# EAGLE design Christmas_Lights (EAGLE 7.5.0)
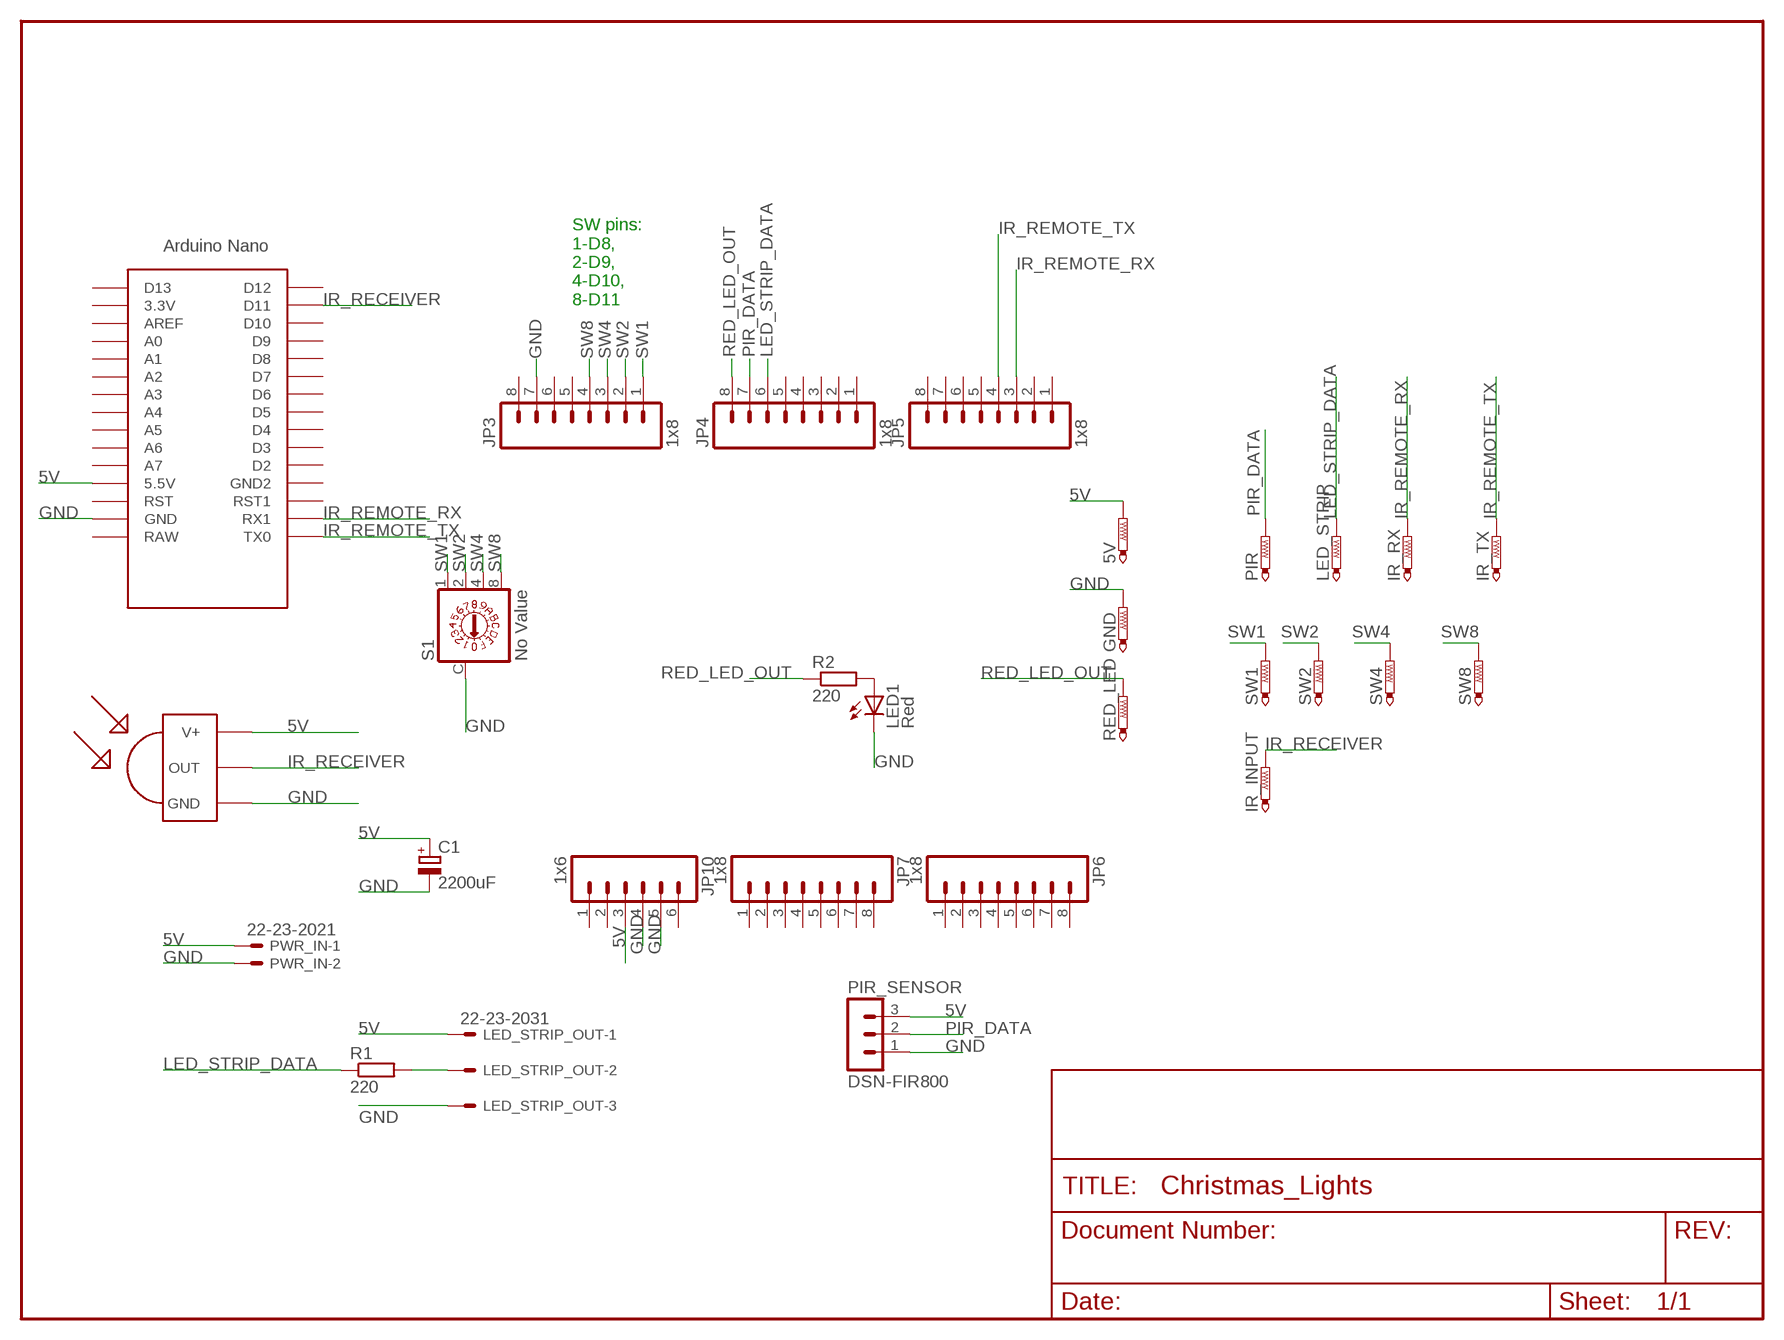
[diagram p0: schematic, sheet 1]

## Parts
5V  PTR1PAD1-13  [P1-13]
C1  2200uF  CPOL-EUE5-13  [E5-13]
GND  PTR1PAD1-13  [P1-13]
IR_INPUT  PTR1PAD1-13  [P1-13]
IR_RX  PTR1PAD1-13  [P1-13]
IR_TX  PTR1PAD1-13  [P1-13]
JP3  1x8  M08LOCK  [1X08_LOCK]
JP4  1x8  M08LOCK  [1X08_LOCK]
JP5  1x8  M08LOCK  [1X08_LOCK]
JP6  1x8  M08LOCK  [1X08_LOCK]
JP7  1x8  M08LOCK  [1X08_LOCK]
JP10  1x6  M06LOCK  [1X06_LOCK]
LED1  Red  LED5MM  [LED5MM]
LED_STRIP  PTR1PAD1-13  [P1-13]
LED_STRIP_OUT  22-23-2031  [22-23-2031]
PIR  PTR1PAD1-13  [P1-13]
PIR_SENSOR  DSN-FIR800  MA03-1  [MA03-1]
PWR_IN  22-23-2021  [22-23-2021]
R1  220  R-EU_0204/7  [0204/7]
R2  220  R-EU_0204/7  [0204/7]
RED_LED  PTR1PAD1-13  [P1-13]
S1  No Value  P103  [P103]
SW1  PTR1PAD1-13  [P1-13]
SW2  PTR1PAD1-13  [P1-13]
SW4  PTR1PAD1-13  [P1-13]
SW8  PTR1PAD1-13  [P1-13]
TSOP31328  TSOP 31238  TSOP1730  [TSOP17XX]
U$1  NANO  [NANO]

## Nets
5V [POWER]: 5V.TP C1.+ JP10.3 LED_STRIP_OUT.1 PIR_SENSOR.3 PWR_IN.1 TSOP31328.V+ U$1.5V(5.5V)
GND [POWER]: C1.- GND.TP JP3.7 JP10.4 JP10.5 LED1.K(C) LED_STRIP_OUT.3 PIR_SENSOR.1 PWR_IN.2 S1.C TSOP31328.GND U$1.GND
IR_RECEIVER: IR_INPUT.TP TSOP31328.OUT U$1.D11
IR_REMOTE_RX: IR_RX.TP JP5.3 U$1.RX1
IR_REMOTE_TX: IR_TX.TP JP5.4 U$1.TX0
LED_STRIP_DATA: JP4.6 LED_STRIP.TP R1.1
N$1: LED_STRIP_OUT.2 R1.2
N$3: LED1.A R2.2
PIR_DATA: JP4.7 PIR.TP PIR_SENSOR.2
RED_LED_OUT: JP4.8 R2.1 RED_LED.TP
SW1: JP3.1 S1.1 SW1.TP
SW2: JP3.2 S1.2 SW2.TP
SW4: JP3.3 S1.4 SW4.TP
SW8: JP3.4 S1.8 SW8.TP
Unconnected: JP3.5 JP3.6 JP3.8 JP4.1 JP4.2 JP4.3 JP4.4 JP4.5 JP5.1 JP5.2 JP5.5 JP5.6 JP5.7 JP5.8 JP6.1 JP6.2 JP6.3 JP6.4 JP6.5 JP6.6 JP6.7 JP6.8 JP7.1 JP7.2 JP7.3 JP7.4 JP7.5 JP7.6 JP7.7 JP7.8 JP10.1 JP10.2 JP10.6 U$1.3.3V U$1.A0 U$1.A1 U$1.A2 U$1.A3 U$1.A4 U$1.A5 U$1.A6 U$1.A7 U$1.AREF U$1.D2 U$1.D3 U$1.D4 U$1.D5 U$1.D6 U$1.D7 U$1.D8 U$1.D9 U$1.D10 U$1.D12 U$1.D13 U$1.GND1(GND2) U$1.ICSP1 U$1.ICSP2 U$1.ICSP3 U$1.ICSP4 U$1.ICSP5 U$1.ICSP6 U$1.RAW U$1.RST U$1.RST1

## Notes on the sheet
- SW pins: 
  1-D8,
  2-D9,
  4-D10,
  8-D11

## Library data of the parts
5V GND IR_INPUT IR_RX IR_TX LED_STRIP PIR RED_LED SW1 SW2 SW4 SW8 = testpad:PTR1: TEST PIN
C1 = rcl:CPOL-EU: POLARIZED CAPACITOR, European symbol
JP3-JP7 = SparkFun:M08: Header 8 Standard 8-pin 0.1" header. Use with straight break away headers (SKU : PRT-00116), right angle break away headers (PRT-00553), swiss pins (PRT-00743), machine pins (PRT-00117), and female headers (PRT-00115).
JP10 = SparkFun:M06: Header 6 Standard 6-pin 0.1" header. Use with straight break away headers (SKU : PRT-00116), right angle break away headers (PRT-00553), swiss pins (PRT-00743), machine pins (PRT-00117), and female headers (PRT-00115). Molex polarized connector foot print use with SKU : PRT-08094 with associated crimp pins and housings. NOTES ON THE VARIANTS LOCK and LOCK_LONGPADS... This footprint was designed to help hold the alignment of a through-hole component (i.e. 6-pin header) while soldering it into place. You may notice that each hole has been shifted either up or down by 0.005 of an inch from it's more standard position (which is a perfectly straight line). This slight alteration caused the pins (the squares in the middle) to touch the edges of the holes. Because they are alternating, it causes a "brace" to hold the component in place. 0.005 has proven to be the perfect amount of "off-center" position when using our standard breakaway headers. Although looks a little odd when you look at the bare footprint, once you have a header in there, the alteration is very hard to notice. Also, if you push a header all the way into place, it is covered up entirely on the bottom side. This idea of altering the position of holes to aid alignment will be further integrated into the Sparkfun Library for other footprints. It can help hold any component with 3 or more connection pins.
LED1 = led:LED: LED OSRAM: - CHIPLED LG R971, LG N971, LY N971, LG Q971, LY Q971, LO R971, LY R971 LH N974, LH R974 LS Q976, LO Q976, LY Q976 LO Q996 - Hyper CHIPLED LW Q18S LB Q993, LB Q99A, LB R99A - SideLED LS A670, LO A670, LY A670, LG A670, LP A670 LB A673, LV A673, LT A673, LW A673 LH A674 LY A675 LS A676, LA A676, LO A676, LY A676, LW A676 LS A679, LY A679, LG A679 - Hyper Micro SIDELED® LS Y876, LA Y876, LO Y876, LY Y876 LT Y87S - SmartLED LW L88C, LW L88S LB L89C, LB L89S, LG L890 LS L89K, LO L89K, LY L89K LS L896, LA L896, LO L896, LY L896 - TOPLED LS T670, LO T670, LY T670, LG T670, LP T670 LSG T670, LSP T670, LSY T670, LOP T670, LYG T670 LG T671, LOG T671, LSG T671 LB T673, LV T673, LT T673, LW T673 LH T674 LS T676, LA T676, LO T676, LY T676, LB T676, LH T676, LSB T676, LW T676 LB T67C, LV T67C, LT T67C, LS T67K, LO T67K, LY T67K, LW E67C LS E67B, LA E67B, LO E67B, LY E67B, LB E67C, LV E67C, LT E67C LW T67C LS T679, LY T679, LG T679 LS T770, LO T770, LY T770, LG T770, LP T770 LB T773, LV T773, LT T773, LW T773 LH T774 LS E675, LA E675, LY E675, LS T675 LS T776, LA T776, LO T776, LY T776, LB T776 LHGB T686 LT T68C, LB T68C - Hyper Mini TOPLED® LB M676 - Mini TOPLED Santana® LG M470 LS M47K, LO M47K, LY M47K Source: http://www.osram.convergy.de LUXEON: - LUMILED® LXK2-PW12-R00, LXK2-PW12-S00, LXK2-PW14-U00, LXK2-PW14-V00 LXK2-PM12-R00, LXK2-PM12-S00, LXK2-PM14-U00 LXK2-PE12-Q00, LXK2-PE12-R00, LXK2-PE12-S00, LXK2-PE14-T00, LXK2-PE14-U00 LXK2-PB12-K00, LXK2-PB12-L00, LXK2-PB12-M00, LXK2-PB14-N00, LXK2-PB14-P00, LXK2-PB14-Q00 LXK2-PR12-L00, LXK2-PR12-M00, LXK2-PR14-Q00, LXK2-PR14-R00 LXK2-PD12-Q00, LXK2-PD12-R00, LXK2-PD12-S00 LXK2-PH12-R00, LXK2-PH12-S00 LXK2-PL12-P00, LXK2-PL12-Q00, LXK2-PL12-R00 Source: www.luxeon.com KINGBRIGHT: KA-3528ASYC Source: www.kingbright.com
LED_STRIP_OUT = con-molex:22-23-2031: .100" (2.54mm) Center Header - 3 Pin; MF: MOLEX; MPN: 22-23-2031; OC_FARNELL: 1462950; OC_NEWARK: 30C0862
PIR_SENSOR = con-lstb:MA03-1: PIN HEADER; OC_FARNELL: unknown; OC_NEWARK: unknown
PWR_IN = con-molex:22-23-2021: .100" (2.54mm) Center Header - 2 Pin; MF: MOLEX; MPN: 22-23-2021; OC_FARNELL: 1462926; OC_NEWARK: 25C3832
R1 R2 = resistor:R-EU_: RESISTOR, European symbol
S1 = switch-dil:P103: DIL/CODE SWITCH; OC_FARNELL: unknown; OC_NEWARK: unknown
TSOP31328 = tsop:TSOP1730: IR Receiver and Demodulator
U$1 = Arduino-clone:NANO: Arduino Nano

## Net classes
0 default: width 0.254 mm, drill 0.152 mm, clearance 0.152 mm
1 POWER: width 0.762 mm, drill 0.508 mm, clearance 0.254 mm

## Board
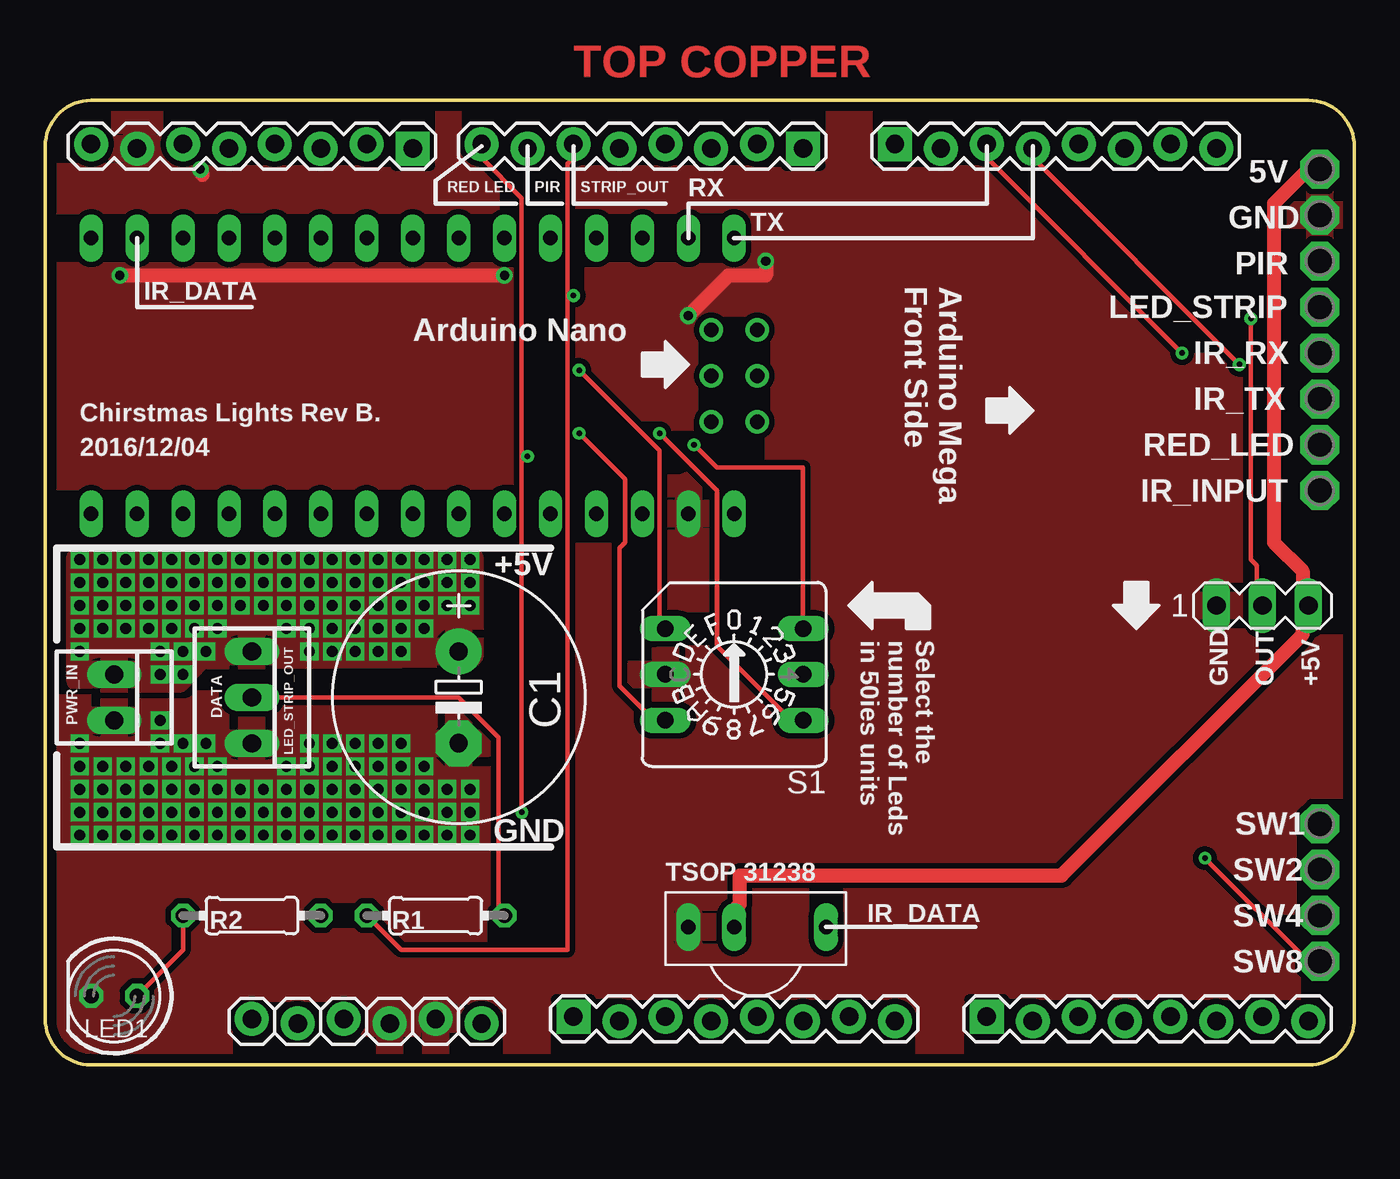
[diagram p1: board, top side]
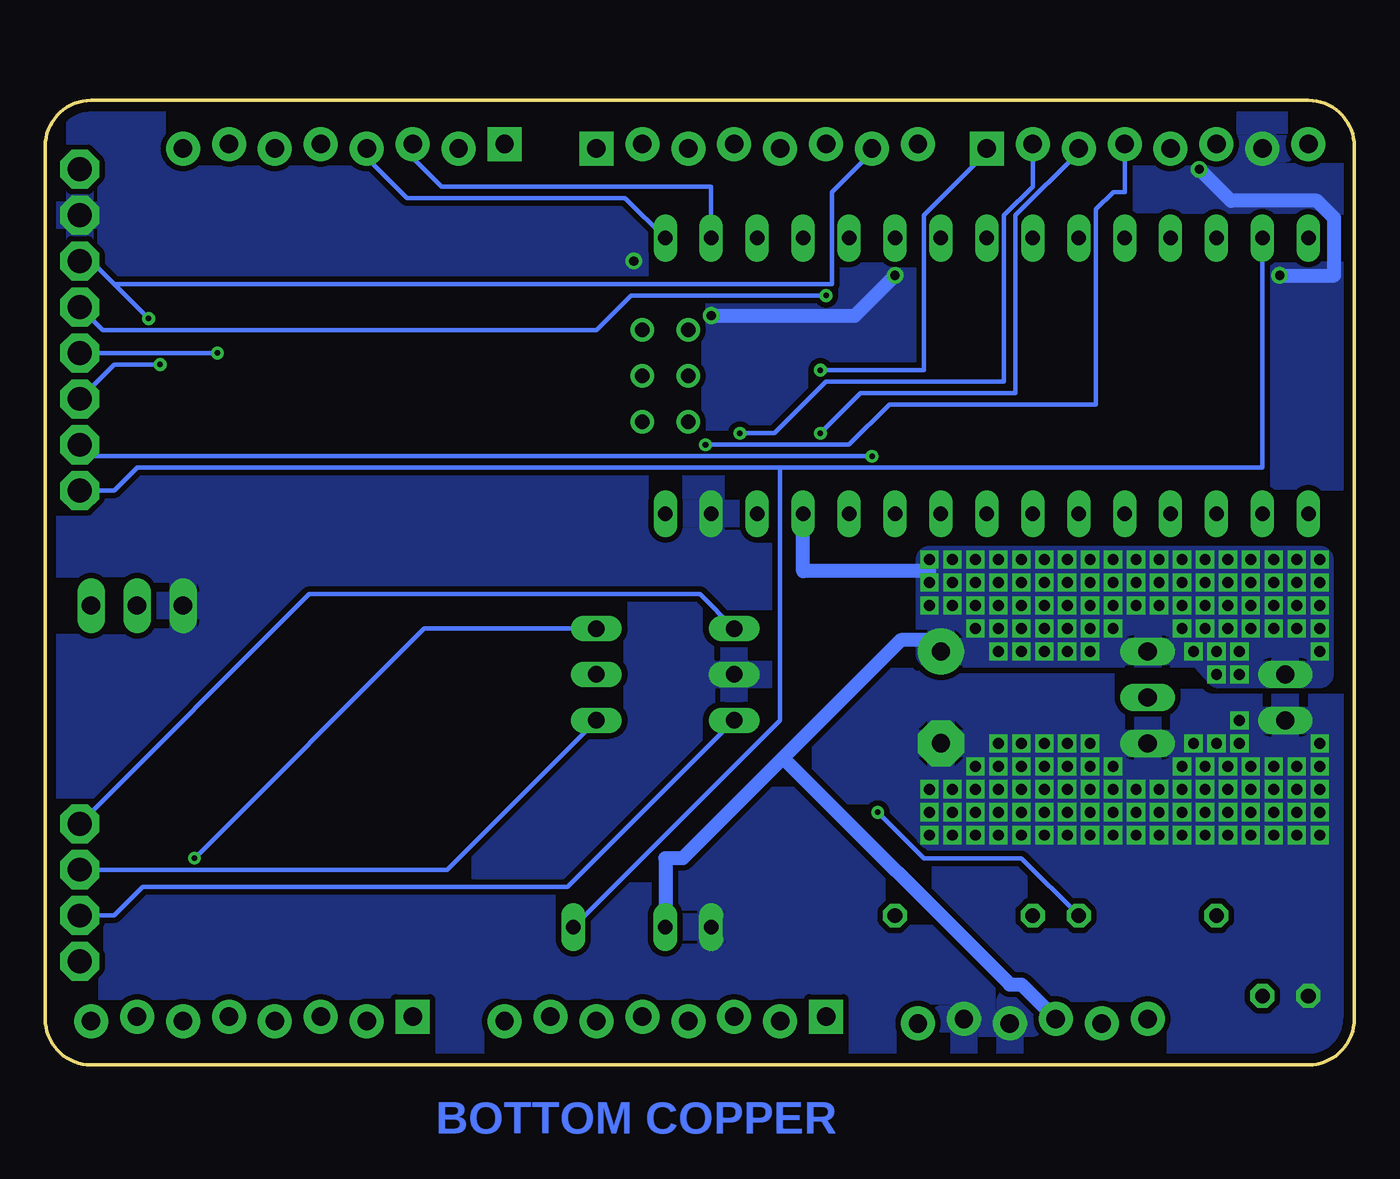
[diagram p2: board, bottom side, seen from below]

Size 72.39 x 53.34 mm. Coordinates in mm from the lower left corner, seen from the top.
Outline: 2.54,0 69.85,0 arc90 72.39,2.54 72.39,50.8 arc90 69.85,53.34 2.54,53.34 arc90 0,50.8 0,2.54 arc90 2.54,0
Copper layers (1*16): Top 0.035mm / dielectric 1.5mm / Bottom 0.035mm
Design rules "NYAKARUHAZ_StandardNYAK": minimum track width 6mil, minimum drill 12mil, track to track 6mil, track to pad 6mil, pad to pad 6mil, via to via 6mil, smd to smd 6mil, copper to edge 20mil, drill to drill 8mil, minimum pad ring 10mil, minimum via ring 8mil, stop-mask expansion 4mil, vias tented up to drill 0mil, thermal gap 6mil

### Footprints (pad centres in the part's own frame; a part is rotated, then mirrored left to right if it is on the bottom)
P1-13 = drill 1.321 pad 2.159 octagon: TP 0,0
E5-13 = drill 1.016 pad 2.54: + -2.54,0 | drill 1.016 pad 2.54 octagon: - 2.54,0
1X08_LOCK = drill 1.016 pad 1.88 square: 1 0,0.127 | drill 1.016 pad 1.88: 2 2.54,-0.127; 3 5.08,0.127; 4 7.62,-0.127; 5 10.16,0.127; 6 12.7,-0.127; 7 15.24,0.127; 8 17.78,-0.127
1X06_LOCK = drill 1.016 pad 1.88: 1 0,0; 2 2.54,-0.254; 3 5.08,0; 4 7.62,-0.254; 5 10.16,0; 6 12.7,-0.254
LED5MM = drill 0.813 octagon: A -1.27,0; K 1.27,0
22-23-2031 = drill 1 long: 1 -2.54,0; 2 0,0; 3 2.54,0
MA03-1 = drill 1.016 long: 1 -2.54,0; 2 0,0; 3 2.54,0
22-23-2021 = drill 1 long: 1 -1.27,0; 2 1.27,0
0204/7 = drill 0.813 octagon: 1 -3.81,0; 2 3.81,0
P103 = drill 0.914 long: 1 3.81,-2.54; 2 -3.81,2.54; 4 3.81,2.54; 8 -3.81,-2.54; C 3.81,0; C1 -3.81,0
TSOP17XX = drill 0.813 long: GND -3.81,0; OUT 3.81,0; V+ -1.27,0
NANO = drill 0.8 long: 3.3V -10.16,24.13; 5V -10.16,-1.27; A0 -10.16,19.05; A1 -10.16,16.51; A2 -10.16,13.97; A3 -10.16,11.43; A4 -10.16,8.89; A5 -10.16,6.35; A6 -10.16,3.81; A7 -10.16,1.27; AREF -10.16,21.59; D2 5.08,1.27; D3 5.08,3.81; D4 5.08,6.35; D5 5.08,8.89; D6 5.08,11.43; D7 5.08,13.97; D8 5.08,16.51; D9 5.08,19.05; D10 5.08,21.59; D11 5.08,24.13; D12 5.08,26.67; D13 -10.16,26.67; GND -10.16,-6.35; GND1 5.08,-1.27; RAW -10.16,-8.89; RST -10.16,-3.81; RST1 5.08,-3.81; RX1 5.08,-6.35; TX0 5.08,-8.89 | drill 0.8: ICSP1 -5.08,-10.16; ICSP2 -5.08,-7.62; ICSP3 -2.54,-10.16; ICSP4 -2.54,-7.62; ICSP5 0,-10.16; ICSP6 0,-7.62

### Placement (x,y rotation side)
5V  70.48,49.53 0 top
C1  22.86,20.32 270 top
GND  70.48,46.99 0 top
IR_INPUT  70.48,31.75 0 top
IR_RX  70.48,39.37 0 top
IR_TX  70.48,36.83 0 top
JP3  20.32,50.8 180 top
JP4  41.91,50.8 180 top
JP5  46.99,50.8 0 top
JP6  52.07,2.54 0 top
JP7  29.21,2.54 0 top
JP10  11.43,2.54 0 top
LED1  3.81,3.81 180 top
LED_STRIP  70.48,41.91 0 top
LED_STRIP_OUT  11.43,20.32 270 top
PIR  70.48,44.45 0 top
PIR_SENSOR  67.31,25.4 0 top
PWR_IN  3.81,20.32 270 top
R1  21.59,8.26 0 top
R2  11.43,8.26 180 top
RED_LED  70.48,34.29 0 top
S1  38.1,21.59 180 top
SW1  70.48,13.34 0 top
SW2  70.48,10.79 0 top
SW4  70.48,8.26 0 top
SW8  70.48,5.71 0 top
TSOP31328  39.37,7.62 0 top
U$1  29.21,40.64 90 top

### Tracks (layer width: path | path; a pad name or v marks a point on that pad's centre or on a via)
5V  (via drill 0.6)
  Top 0.762: 5V.TP 69.85,49.53 67.94,47.62 67.94,28.89 69.53,27.3 69.53,25.72 PIR_SENSOR.3 69.85,25.08 69.53,24.77 69.53,23.81 56.2,10.48 38.42,10.48 38.42,8.89 38.1,8.57 TSOP31328.V+
  Bottom 0.762: U$1.5V 30.48,27.3 23.5,27.3 | TSOP31328.V+ 38.1,11.43 37.15,11.43 31.59,16.99 | 31.59,16.99 25.08,23.5 23.5,23.5 C1.+ | JP10.3 18.42,4.45 19.05,4.45 31.59,16.99
  other vias: 3.18,26.67 4.45,26.67 5.71,26.67 6.98,26.67 8.25,26.67 9.52,26.67 10.79,26.67 12.07,26.67 13.33,26.67 14.61,26.67 15.88,26.67 17.14,26.67 18.42,26.67 19.68,26.67 20.96,26.67 22.22,26.67 23.5,26.67 3.18,25.4 4.45,25.4 5.71,25.4 6.98,25.4 8.25,25.4 9.52,25.4 10.79,25.4 12.07,25.4 13.33,25.4 14.61,25.4 15.88,25.4 17.14,25.4 18.42,25.4 19.68,25.4 20.96,25.4 22.22,25.4 23.5,25.4 3.18,24.13 4.45,24.13 5.71,24.13 6.98,24.13 8.25,24.13 15.88,24.13 17.14,24.13 18.42,24.13 19.68,24.13 20.96,24.13 15.88,22.86 17.14,22.86 18.42,22.86 19.68,22.86 6.35,22.86 14.61,24.13 14.61,22.86 7.62,22.86 3.18,27.94 4.45,27.94 5.71,27.94 6.98,27.94 8.25,27.94 9.52,27.94 10.79,27.94 12.07,27.94 13.33,27.94 14.61,27.94 15.88,27.94 17.14,27.94 18.42,27.94 19.68,27.94 20.96,27.94 22.22,27.94 1.91,27.94 1.91,26.67 1.91,25.4 1.91,24.13 9.52,24.13 13.33,24.13 6.35,21.59 7.62,21.59 8.89,22.86 1.91,22.86 23.5,27.94
  pour Top (isolate 0.406, rank 2): 1.91,21.34 7.37,21.34 8.51,22.61 23.5,22.73 23.5,27.94 1.91,27.94
  pour Bottom (isolate 0.254): 1.91,21.59 7.49,21.59 8.51,22.73 23.5,22.73 23.5,27.94 1.91,27.94
GND  (via drill 0.51, 0.6)
  Top 0.762: v25.4,43.66 v4.13,43.66 | v35.56,41.43 37.78,43.66 39.85,43.66 v39.85,44.45 | v8.57,49.53 8.71,49.2
  Bottom 0.762: v8.57,49.53 6.83,47.78 2.06,47.78 1.11,46.83 1.11,43.66 v4.13,43.66 | v25.4,43.66 27.62,41.43 v35.56,41.43
  other vias: 3.18,16.51 4.45,16.51 5.71,16.51 6.98,16.51 3.18,15.24 4.45,15.24 5.71,15.24 6.98,15.24 8.25,15.24 9.52,15.24 10.79,15.24 12.07,15.24 13.33,15.24 14.61,15.24 15.88,15.24 17.14,15.24 18.42,15.24 19.68,15.24 20.96,15.24 22.22,15.24 23.5,15.24 15.88,16.51 17.14,16.51 18.42,16.51 15.88,17.78 17.14,17.78 18.42,17.78 19.68,16.51 19.68,17.78 20.96,16.51 3.18,13.97 4.45,13.97 5.71,13.97 6.98,13.97 8.25,13.97 9.52,13.97 10.79,13.97 12.07,13.97 13.33,13.97 14.61,13.97 15.88,13.97 17.14,13.97 18.42,13.97 19.68,13.97 20.96,13.97 22.22,13.97 23.5,13.97 8.25,16.51 7.62,17.78 14.61,17.78 14.61,16.51 3.18,12.7 4.45,12.7 5.71,12.7 6.98,12.7 8.25,12.7 9.52,12.7 10.79,12.7 12.07,12.7 13.33,12.7 14.61,12.7 15.88,12.7 17.14,12.7 1.91,16.51 1.91,15.24 1.91,13.97 1.91,12.7 18.42,12.7 19.68,12.7 20.96,12.7 22.22,12.7 9.52,16.51 13.33,16.51 6.35,19.05 6.35,17.78 8.89,17.78 1.91,17.78 23.5,12.7
  pour Top (isolate 0.254): 1.91,12.7 1.91,19.05 7.37,19.05 8.51,17.78 23.5,17.78 23.5,12.7
  pour Bottom (isolate 0.254): 1.91,19.05 7.49,19.05 8.51,17.78 23.5,17.78 23.5,12.7 1.91,12.7
  pour Bottom (isolate 0.305, rank 6): -0.64,53.98 -0.64,-0.64 73.02,-0.64 73.02,53.98
  pour Top (isolate 0.305, rank 6): -0.64,53.98 -0.64,-0.64 73.02,-0.64 73.02,53.98
IR_RECEIVER
  Bottom 0.254: U$1.D11 5.08,33.02 31.75,33.02 | 31.75,33.02 67.31,33.02 68.58,31.75 IR_INPUT.TP | TSOP31328.OUT 31.75,19.05 31.75,33.02
IR_REMOTE_RX  (via drill 0.3)
  Top 0.254: v62.86,39.37 52.07,50.16 JP5.3
  Bottom 0.254: U$1.RX1 35.56,48.58 50.48,48.58 52.07,50.16 JP5.3 | v62.86,39.37 IR_RX.TP
IR_REMOTE_TX  (via drill 0.3)
  Top 0.254: v66.04,38.73 54.61,50.16 JP5.4
  Bottom 0.254: U$1.TX0 40.32,47.94 52.39,47.94 54.61,50.16 JP5.4 | IR_TX.TP 68.58,38.73 v66.04,38.73
LED_STRIP_DATA  (via drill 0.3)
  Top 0.254: R1.1 19.68,6.35 28.89,6.35 28.89,42.55 | 28.89,42.55 28.89,49.85 29.21,50.16 JP4.6 | 28.89,42.55 v29.21,42.55
  Bottom 0.254: LED_STRIP.TP 69.22,40.64 41.91,40.64 40,42.55 v29.21,42.55
N$1
  Top 0.254: R1.2 25.08,8.57 25.08,18.1 22.86,20.32 LED_STRIP_OUT.2
N$3
  Top 0.254: LED1.A 7.62,6.35 R2.2
PIR_DATA  (via drill 0.3)
  Top 0.254: PIR_SENSOR.2 66.99,25.72 66.99,27.62 66.67,27.94 v66.67,41.27
  Bottom 0.254: 68.58,43.18 69.85,44.45 PIR.TP | 68.58,43.18 v66.67,41.27 | 68.58,43.18 28.89,43.18 28.89,48.26 26.67,50.48 JP4.7
RED_LED_OUT  (via drill 0.3)
  Top 0.254: 26.35,33.66 26.35,47.94 24.13,50.16 JP4.8 | 26.35,33.66 v26.35,13.97 | 26.35,33.66 v26.67,33.66
  Bottom 0.254: R2.1 18.42,11.43 23.81,11.43 v26.35,13.97 | RED_LED.TP 69.85,33.66 v26.67,33.66
SW1  (via drill 0.3)
  Top 0.254: v29.53,38.42 33.97,33.97 33.97,24.45 S1.1
  Bottom 0.254: S1.1 36.19,26.04 57.78,26.04 SW1.TP | v29.53,38.42 23.81,38.42 23.81,46.99 20.32,50.48 JP3.1
SW2  (via drill 0.3)
  Top 0.254: v33.97,34.92 37.15,31.75 37.15,23.18 41.28,19.05 S1.2
  Bottom 0.254: S1.2 50.16,10.79 SW2.TP | JP3.2 17.78,48.58 19.37,46.99 19.37,37.78 29.21,37.78 32.07,34.92 v33.97,34.92
SW4  (via drill 0.3)
  Top 0.254: v29.53,34.92 32.07,32.38 32.07,28.89 31.75,28.57 31.75,20.95 33.66,19.05 S1.4
  Bottom 0.254: S1.4 43.5,9.84 66.99,9.84 68.58,8.26 SW4.TP | v29.53,34.92 27.31,37.15 18.73,37.15 18.73,46.99 15.24,50.48 JP3.3
SW8  (via drill 0.3)
  Top 0.254: v64.13,11.43 69.85,5.71 SW8.TP | v35.88,34.29 37.15,33.02 41.91,33.02 S1.8
  Bottom 0.254: S1.8 51.44,24.13 v64.13,11.43 | JP3.4 12.7,48.26 13.33,48.26 14.29,47.31 14.29,36.51 25.72,36.51 27.94,34.29 v35.88,34.29

### Text on the board
Top: TOP COPPER
Bottom: BOTTOM COPPER
Document: Arduino Back | Arduino Front | Front side
_tsilk: RED LED | PIR | STRIP_OUT | RX | TX | Arduino Mega / Front Side | IR_DATA | Arduino Nano | Chirstmas Lights Rev B. | 2016/12/04 | +5V | Select the / number of Leds / in 50ies units | GND | OUT | +5V | DATA | GND | TSOP 31238 | IR_DATA